# Altium schematic sheet uC.SchDoc
size A3; DocumentNumber: 3; SheetNumber: 3
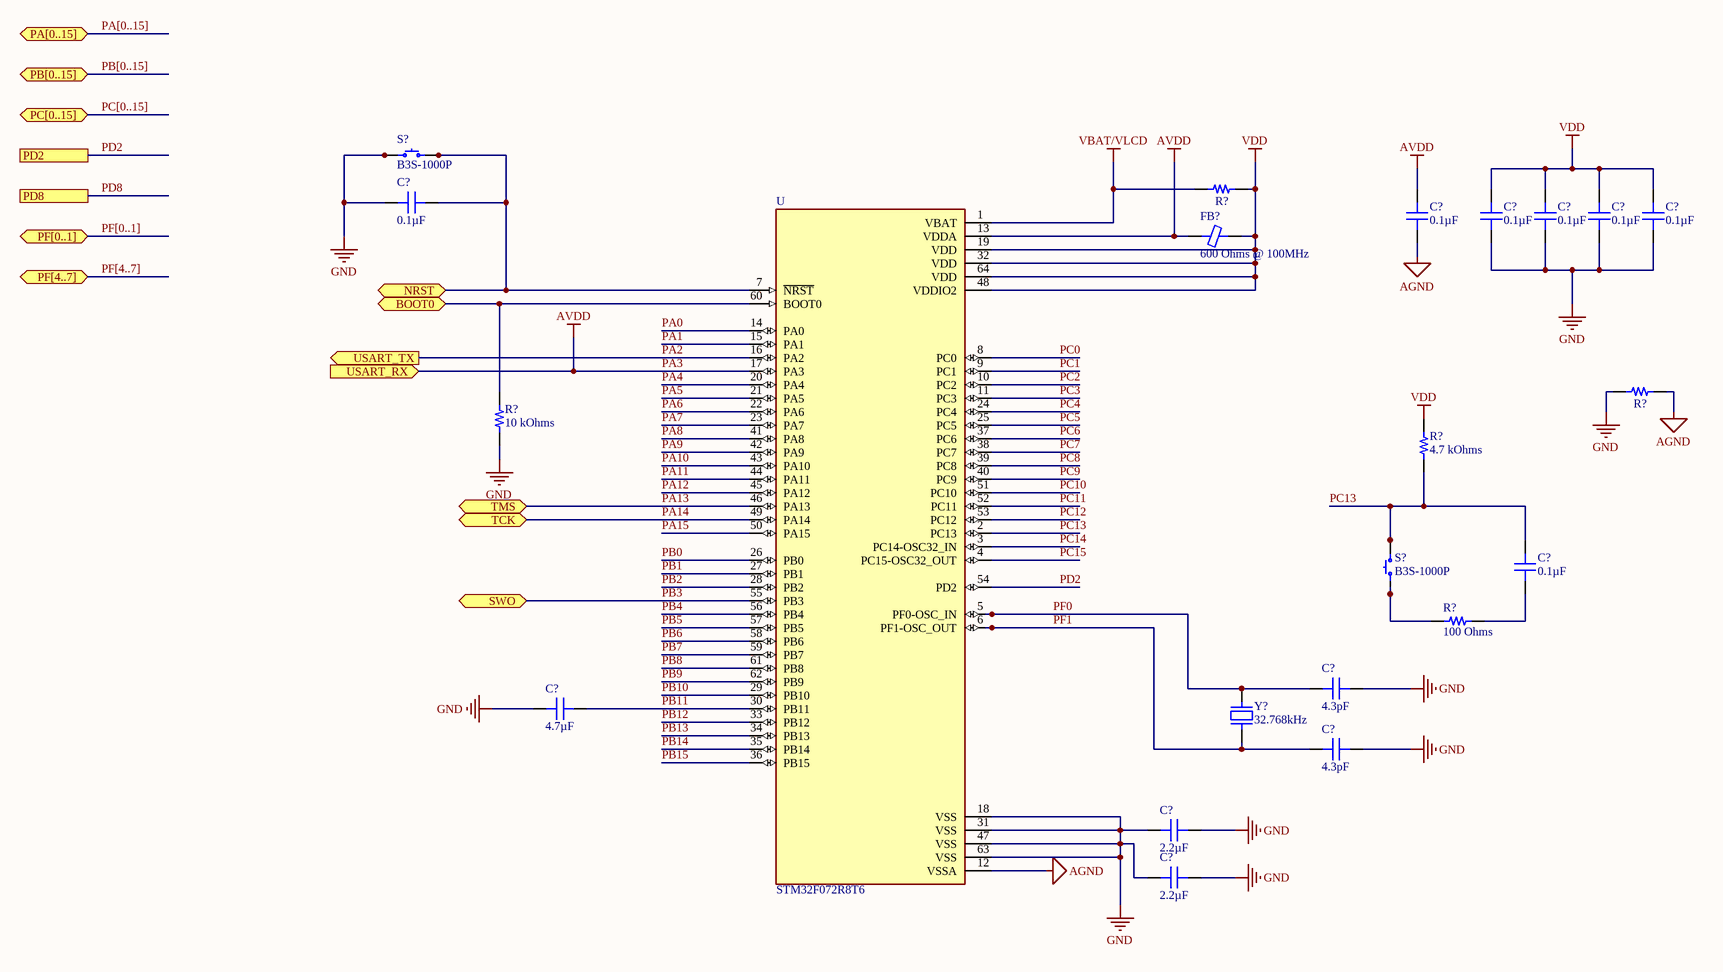
[diagram p0: uC.SchDoc]

## Parts
(Parts that share a designator on the sheet are numbered #1, #2 ... from top to bottom, then left to right.)
C?#1  0.1µF  [CAP 0805_2012]
C?#2  0.1µF  [CAP 0805_2012]
C?#3  0.1µF  [CAP 0805_2012]
C?#4  0.1µF  [CAP 0805_2012]
C?#5  0.1µF  [CAP 0805_2012]
C?#6  0.1µF  [CAP 0805_2012]
C?#7  0.1µF  [CAP 0805_2012]
C?#8  4.3pF  [CAP 0805_2012]
C?#9  4.7µF  [CAP 0805_2012]
C?#10  4.3pF  [CAP 0805_2012]
C?#11  2.2µF  [CAP 0805_2012]
C?#12  2.2µF  [CAP 0805_2012]
FB?  600 Ohms @ 100MHz  [FER 0603_1608]
R?#1  (no value)  [RES 0603_1608]
R?#2  (no value)  [RES 0603_1608]
R?#3  10 kOhms  [RES 0805_2012]
R?#4  4.7 kOhms  [RES 0805_2012]
R?#5  100 Ohms  [RES 0805_2012]
S?#1  B3S-1000P  [OMRON B3S-1000P]
S?#2  B3S-1000P  [OMRON B3S-1000P]
U  STM32F072R8T6  [QFP50P1200X1200X160-64N]
Y?  32.768kHz  [ABRACON ABS25]

## Ports
BOOT0 (bidir), NRST (bidir), PA[0..15] (bidir), PB[0..15] (bidir), PC[0..15] (bidir), PD2, PD8, PF[0..1] (bidir), PF[4..7] (bidir), SWO (bidir), TCK (bidir), TMS (bidir), USART_RX (in), USART_TX (out)

## Nets
AGND: C?#2.1 R?#2.2 U.12(VSSA)
GND: C?#1.2 C?#3.1 C?#4.1 C?#5.1 C?#6.1 C?#8.2 C?#9.1 C?#10.2 C?#11.1 C?#11.2 C?#12.1 C?#12.2 R?#2.1 R?#3.1 S?#1.1 S?#1.2 U.18(VSS) U.31(VSS) U.47(VSS) U.63(VSS)
PA3: C?#2.2 FB?.1 U.13(VDDA) U.17(PA3) ; port USART_RX  [also labelled AVDD]
VBAT/VLCD: R?#1.1 U.1(VBAT)
VDD: C?#3.2 C?#4.2 C?#5.2 C?#6.2 FB?.2 R?#1.2 R?#4.2 U.19(VDD) U.32(VDD) U.48(VDDIO2) U.64(VDD)
BOOT0: R?#3.2 U.60(BOOT0) ; port BOOT0
NRST: C?#1.1 S?#1.3 S?#1.4 U.7(~{NRST}) ; port NRST
PA0: U.14(PA0)
PA1: U.15(PA1)
PA2: U.16(PA2) ; port USART_TX
PA4: U.20(PA4)
PA5: U.21(PA5)
PA6: U.22(PA6)
PA7: U.23(PA7)
PA8: U.41(PA8)
PA9: U.42(PA9)
PA10: U.43(PA10)
PA11: U.44(PA11)
PA12: U.45(PA12)
PA13: U.46(PA13) ; port TMS
PA14: U.49(PA14) ; port TCK
PA15: U.50(PA15)
PB0: U.26(PB0)
PB1: U.27(PB1)
PB2: U.28(PB2)
PB3: U.55(PB3) ; port SWO
PB4: U.56(PB4)
PB5: U.57(PB5)
PB6: U.58(PB6)
PB7: U.59(PB7)
PB8: U.61(PB8)
PB9: U.62(PB9)
PB10: U.29(PB10)
PB11: C?#9.2 U.30(PB11)
PB12: U.33(PB12)
PB13: U.34(PB13)
PB14: U.35(PB14)
PB15: U.36(PB15)
PC0: U.8(PC0)
PC1: U.9(PC1)
PC2: U.10(PC2)
PC3: U.11(PC3)
PC4: U.24(PC4)
PC5: U.25(PC5)
PC6: U.37(PC6)
PC7: U.38(PC7)
PC8: U.39(PC8)
PC9: U.40(PC9)
PC10: U.51(PC10)
PC11: U.52(PC11)
PC12: U.53(PC12)
PC13: C?#7.2 R?#4.1 S?#2.3 S?#2.4 U.2(PC13)
PC14: U.3(PC14-OSC32_IN)
PC15: U.4(PC15-OSC32_OUT)
PD2: U.54(PD2) ; port PD2
PD8: port PD8
PF0: C?#8.1 U.5(PF0-OSC_IN) Y?.4
PF1: C?#10.1 U.6(PF1-OSC_OUT) Y?.1
NetC?#7_1: C?#7.1 R?#5.2
NetR?#5_1: R?#5.1 S?#2.1 S?#2.2

## Buses and harness runs
bus PA[0..15] = port PA[0..15]
bus PB[0..15] = port PB[0..15]
bus PC[0..15] = port PC[0..15]
bus PF[0..1] = port PF[0..1]
bus PF[4..7] = port PF[4..7]

## Library data of the parts
C?#1-C?#7 = AC0805KKX8R9BB104: CAP CER 0805 10% X8R 50V 100NF; Manufacturer: Yageo; Part Number: AC0805KKX8R9BB104; Value: 0.1µF; Applications: Automotive; Capacitance: 0.1µF; ComponentLink1Description: Datasheet; ComponentLink1URL: http://www.yageo.com/documents/recent/AC0805KKX8R9BB104.pdf; ComponentLink2Description: DigiKey Link; ComponentLink2URL: http://digikey.com/product-detail/en/yageo/AC0805KKX8R9BB104/311-4624-1-ND/9699550; Device Package: 0805 (2012 Metric); LastUpdated: 02/09/2020 01:04:20; Lifecycle Status: Active; Minimum Order: 1; Mounting Type: Surface Mount, MLCC; Operating Temperature: -55°C ~ 150°C; Package / Case: 0805 (2012 Metric); Packaging: TapeAndReel; PartId: 14076; Part Status: Active; Price: 0.06; Ratings: AEC-Q200; Series: AC; Size / Dimension: 0.079" L x 0.049" W (2.00mm x 1.25mm); Supplier 1: DigiKey; Supplier Part Number 1: 311-4624-1-ND; Temperature Coefficient: X8R; Thickness (Max): 0.057" (1.45mm); Tolerance: ±10%; Voltage - Rated: 50V
C?#8 C?#10 = 08051A4R3CAT2A: CAP CER 4.3PF 100V NP0 0805; Manufacturer: AVX Corporation; Temperature Coefficient: C0G, NP0; Tolerance: ±0.25pF; Part Number: 08051A4R3CAT2A; Value: 4.3pF; Applications: General Purpose; Capacitance: 4.3pF; ComponentLink1Description: Datasheet; ComponentLink1URL: http://datasheets.avx.com/C0GNP0-Dielectric.pdf; ComponentLink2Description: DigiKey Link; ComponentLink2URL: http://digikey.com/product-detail/en/avx-corporation/08051A4R3CAT2A/478-10404-1-ND/6797329; Device Package: 0805 (2012 Metric); LastUpdated: 02/09/2020 01:04:08; Lifecycle Status: Active; Minimum Order: 1; Mounting Type: Surface Mount, MLCC; Operating Temperature: -55°C ~ 125°C; Package / Case: 0805 (2012 Metric); Packaging: TapeAndReel; PartId: 17882; Part Status: Active; Price: 0.04; Series: -; Size / Dimension: 0.079" L x 0.049" W (2.01mm x 1.25mm); Supplier 1: DigiKey; Supplier Part Number 1: 478-10404-1-ND; Thickness (Max): 0.037" (0.94mm); Voltage - Rated: 100V
C?#9 = TMK212BBJ475KGHT: CAP CER 4.7UF 25V X5R 0805; Manufacturer: Taiyo Yuden; Tolerance: ±10%; Part Number: TMK212BBJ475KGHT; Value: 4.7µF; Applications: Automotive; Capacitance: 4.7µF; ComponentLink1Description: Datasheet; ComponentLink1URL: https://www.yuden.co.jp/productdata/catalog/mlcc_all_hq_e.pdf; ComponentLink2Description: DigiKey Link; ComponentLink2URL: http://digikey.com/product-detail/en/taiyo-yuden/TMK212BBJ475KGHT/587-3713-1-ND/4811183; Device Package: 0805 (2012 Metric); LastUpdated: 02/09/2020 01:04:32; Lifecycle Status: Active; Minimum Order: 1; Mounting Type: Surface Mount, MLCC; Operating Temperature: -55°C ~ 85°C; Package / Case: 0805 (2012 Metric); Packaging: TapeAndReel; PartId: 8142; Part Status: Active; Price: 0.07; Ratings: AEC-Q200; Series: M; Size / Dimension: 0.079" L x 0.049" W (2.00mm x 1.25mm); Supplier 1: DigiKey; Supplier Part Number 1: 587-3713-1-ND; Temperature Coefficient: X5R; Thickness (Max): 0.057" (1.45mm); Voltage - Rated: 25V
C?#11 C?#12 = CL21F225ZOFNNNE: CAP CER 2.2UF 16V Y5V 0805; Manufacturer: Samsung Electro-Mechanics; Temperature Coefficient: Y5V (F); Tolerance: -20%, +80%; Part Number: CL21F225ZOFNNNE; Value: 2.2µF; Applications: General Purpose; Capacitance: 2.2µF; ComponentLink1Description: Datasheet; ComponentLink1URL: http://www.samsungsem.com/kr/support/product-search/mlcc/CL21F225ZOFNNNE.jsp; ComponentLink2Description: DigiKey Link; ComponentLink2URL: http://digikey.com/product-detail/en/samsung-electro-mechanics/CL21F225ZOFNNNE/1276-3016-1-ND/3891102; Device Package: 0805 (2012 Metric); LastUpdated: 02/09/2020 01:04:16; Lifecycle Status: Active; Minimum Order: 1; Mounting Type: Surface Mount, MLCC; Operating Temperature: -30°C ~ 85°C; Package / Case: 0805 (2012 Metric); Packaging: TapeAndReel; PartId: 15359; Part Status: Active; Price: 0.03; Series: CL; Size / Dimension: 0.079" L x 0.049" W (2.00mm x 1.25mm); Supplier 1: DigiKey; Supplier Part Number 1: 1276-3016-1-ND; Thickness (Max): 0.053" (1.35mm); Voltage - Rated: 16V
FB? = BLM18DN601SZ1D: FERRITEBEAD SMD Z100MHZ=600OHM 7; Manufacturer: Murata Electronics; Current Rating (Max): 700mA; Number of Lines: 1; Part Number: BLM18DN601SZ1D; ComponentLink1Description: Datasheet; ComponentLink1URL: https://www.murata.com/en-us/api/pdfdownloadapi?cate=luNoiseSupprFilteChipFerriBead&partno=BLM18DN601SZ1%23; ComponentLink2Description: DigiKey Link; ComponentLink2URL: http://digikey.com/product-detail/en/murata-electronics/BLM18DN601SZ1D/490-18575-1-ND/10135586; Device Package: 0603 (1608 Metric); Height (Max): 0.037" (0.95mm); Impedance @ Frequency: 600 Ohms @ 100MHz; LastUpdated: 02/09/2020 01:18:18; Lifecycle Status: Active; Minimum Order: 1; Mounting Type: Surface Mount; Operating Temperature: -55°C ~ 125°C; Package / Case: 0603 (1608 Metric); Packaging: TapeAndReel; PartId: 783; Part Status: Active; Price: 0.05; Ratings: AEC-Q200; Series: EMIFIL®, BLM18; Size / Dimension: 0.063" L x 0.031" W (1.60mm x 0.80mm); Supplier 1: DigiKey; Supplier Part Number 1: 490-18575-1-ND; Value: 600 Ohms @ 100MHz
R?#1 R?#2 = RCA06030000ZSEA: RES SMD 0 OHM JUMPER 1/10W 0603; Manufacturer: Vishay Dale; Power (Watts): 0.1W, 1/10W; Part Number: RCA06030000ZSEA; ComponentLink1Description: Datasheet; ComponentLink1URL: http://www.vishay.com/docs/20037/rcae3.pdf; ComponentLink2Description: DigiKey Link; ComponentLink2URL: http://digikey.com/product-detail/en/vishay-dale/RCA06030000ZSEA/541-2192-1-ND/4946845; Composition: Thick Film; Device Package: 0603 (1608 Metric); Features: Anti-Sulfur, Automotive AEC-Q200; Height - Seated (Max): 0.020" (0.50mm); LastUpdated: 02/09/2020 01:10:23; Lifecycle Status: Active; Minimum Order: 1; Number of Terminations: 2; Operating Temperature: -55°C ~ 155°C; Package / Case: 0603 (1608 Metric); Packaging: TapeAndReel; PartId: 5740; Part Status: Active; Price: 0.01; Ratings: AEC-Q200; Series: RCA; Size / Dimension: 0.061" L x 0.033" W (1.55mm x 0.85mm); Supplier 1: DigiKey; Supplier Part Number 1: 541-2192-1-ND; Supplier Device Package: 0603; Tolerance: Jumper
R?#3 = CPF0805B10KE: RES SMD 10K OHM 0.1% 1/10W 0805; Manufacturer: TE Connectivity Passive Product; Power (Watts): 0.1W, 1/10W; Temperature Coefficient: ±25ppm/°C; Part Number: CPF0805B10KE; Value: 10 kOhms; ComponentLink1Description: Datasheet; ComponentLink1URL: https://www.te.com/commerce/DocumentDelivery/DDEController?Action=srchrtrv&DocNm=1773200&DocType=DS&DocLang=English; ComponentLink2Description: DigiKey Link; ComponentLink2URL: http://digikey.com/product-detail/en/te-connectivity-passive-product/CPF0805B10KE/A106043CT-ND/3477679; Composition: Thin Film; Device Package: 0805 (2012 Metric); Height - Seated (Max): 0.026" (0.65mm); LastUpdated: 02/09/2020 01:15:24; Lifecycle Status: Active; Minimum Order: 1; Number of Terminations: 2; Operating Temperature: -55°C ~ 155°C; Package / Case: 0805 (2012 Metric); Packaging: TapeAndReel; PartId: 27724; Part Status: Active; Price: 0.09; Resistance: 10 kOhms; Series: CPF, Neohm; Size / Dimension: 0.079" L x 0.049" W (2.00mm x 1.25mm); Supplier 1: DigiKey; Supplier Part Number 1: A106043CT-ND; Supplier Device Package: 0805; Tolerance: ±0.1%
R?#4 = CRCW08054K70JNTA: RES SMD 4.7K OHM 5% 1/8W 0805; Manufacturer: Vishay Dale; Power (Watts): 0.125W, 1/8W; Temperature Coefficient: ±200ppm/°C; Part Number: CRCW08054K70JNTA; Value: 4.7 kOhms; ComponentLink1Description: Datasheet; ComponentLink1URL: http://www.vishay.com/docs/20008/dcrcw.pdf; ComponentLink2Description: DigiKey Link; ComponentLink2URL: http://digikey.com/product-detail/en/vishay-dale/CRCW08054K70JNTA/541-3029-1-ND/6073672; Composition: Thick Film; Device Package: 0805 (2012 Metric); Features: Automotive AEC-Q200; Height - Seated (Max): 0.020" (0.50mm); LastUpdated: 02/09/2020 01:15:17; Lifecycle Status: Active; Minimum Order: 1; Number of Terminations: 2; Operating Temperature: -55°C ~ 155°C; Package / Case: 0805 (2012 Metric); Packaging: TapeAndReel; PartId: 30842; Part Status: Active; Price: 0.01; Ratings: AEC-Q200; Resistance: 4.7 kOhms; Series: CRCW; Size / Dimension: 0.079" L x 0.049" W (2.00mm x 1.25mm); Supplier 1: DigiKey; Supplier Part Number 1: 541-3029-1-ND; Supplier Device Package: 0805; Tolerance: ±5%
R?#5 = CRCW0805100RFKEB: RES SMD 100 OHM 1% 1/8W 0805; Manufacturer: Vishay Dale; Power (Watts): 0.125W, 1/8W; Temperature Coefficient: ±100ppm/°C; Part Number: CRCW0805100RFKEB; Value: 100 Ohms; ComponentLink1Description: Datasheet; ComponentLink1URL: http://www.vishay.com/docs/20035/dcrcwe3.pdf; ComponentLink2Description: DigiKey Link; ComponentLink2URL: http://digikey.com/product-detail/en/vishay-dale/CRCW0805100RFKEB/541-CRCW0805100RFKEBCT-ND/11501183; Composition: Thick Film; Device Package: 0805 (2012 Metric); Features: Automotive AEC-Q200; LastUpdated: 02/09/2020 01:14:22; Lifecycle Status: Active; Minimum Order: 1; Number of Terminations: 2; Operating Temperature: -55°C ~ 155°C; Package / Case: 0805 (2012 Metric); Packaging: TapeAndReel; PartId: 57124; Price: 0.01; Ratings: AEC-Q200; Resistance: 100 Ohms; Series: CRCW; Supplier 1: DigiKey; Supplier Part Number 1: 541-CRCW0805100RFKEBCT-ND; Supplier Device Package: 0805; Tolerance: ±1%
S?#1 S?#2 = B3S-1000P: SWITCH TACTILE SPST-NO 0.05A 24V; Manufacturer: Omron Electronics Inc-EMC Div; Actuator Height off PCB, Vertical: 4.30mm; Actuator Orientation: Top Actuated; Actuator Type: Standard; Contact Rating @ Voltage: 0.05A @ 24VDC; Illumination: Non-Illuminated; Ingress Protection: IP67 - Dust Tight, Waterproof; Operating Force: 160gf; Outline: 6.60mm x 6.00mm; Switch Function: Off-Mom; Part Number: B3S-1000P; Circuit: SPST-NO; ComponentLink1Description: Datasheet; ComponentLink1URL: https://omronfs.omron.com/en_US/ecb/products/pdf/en-b3s.pdf; ComponentLink2Description: DigiKey Link; ComponentLink2URL: http://digikey.com/product-detail/en/omron-electronics-inc-emc-div/B3S-1000P/SW836CT-ND/700012; Features: Sealed - Fully; LastUpdated: 09/04/2020 09:57:13; Lifecycle Status: Active; Minimum Order: 1; Mounting Type: Surface Mount; Operating Temperature: -25°C ~ 70°C; Packaging: TapeAndReel; Part Status: Active; Price: 0.39; Series: B3S; Supplier 1: DigiKey; Supplier Part Number 1: SW836CT-ND; Termination Style: Gull Wing
U = STM32F072R8T6: ARMÂ® CortexÂ®-M0 STM32F0 Microcontroller IC 32-Bit 48MHz 64KB _64K x 8_ FLASH 64-LQFP _10x10_; MF: STMicroelectronics; Value: *; Price: None; Package: LQFP-64 STMicroelectronics; SnapEDA_Link: https://www.snapeda.com/parts/STM32F072R8T6/STMicroelectronics/view-part/226402/?ref=snap; Availability: Unavailable; MP: STM32F072R8T6
Y? = ABS25-32.768KHZ-6-T: CRYSTAL 32.7680KHZ 6PF SMD; Manufacturer: Abracon LLC; ESR (Equivalent Series Resistance): 50 kOhms; Frequency Tolerance: ±20ppm; Operating Mode: Fundamental; Part Number: ABS25-32.768KHZ-6-T; ComponentLink1Description: Datasheet; ComponentLink1URL: https://abracon.com/Resonators/abs25.pdf; ComponentLink2Description: DigiKey Link; ComponentLink2URL: http://digikey.com/product-detail/en/abracon-llc/ABS25-32.768KHZ-6-T/535-10240-1-ND/2218053; Frequency: 32.768kHz; Height - Seated (Max): 0.098" (2.50mm); LastUpdated: 02/09/2020 01:21:47; Lifecycle Status: Active; Load Capacitance: 6pF; Minimum Order: 1; Mounting Type: Surface Mount; Operating Temperature: -40°C ~ 85°C; Package / Case: 4-SOJ, 5.50mm pitch; Packaging: TapeAndReel; PartId: 395; Part Status: Active; Price: 0.42; Series: ABS25; Size / Dimension: 0.315" L x 0.150" W (8.00mm x 3.80mm); Supplier 1: DigiKey; Supplier Part Number 1: 535-10240-1-ND; Type: kHz Crystal (Tuning Fork); Value: 32.768kHz